# Altium schematic sheet Schemtaic Sheet 3.SchDoc
size A4; SheetNumber: 3; SheetTotal: 3
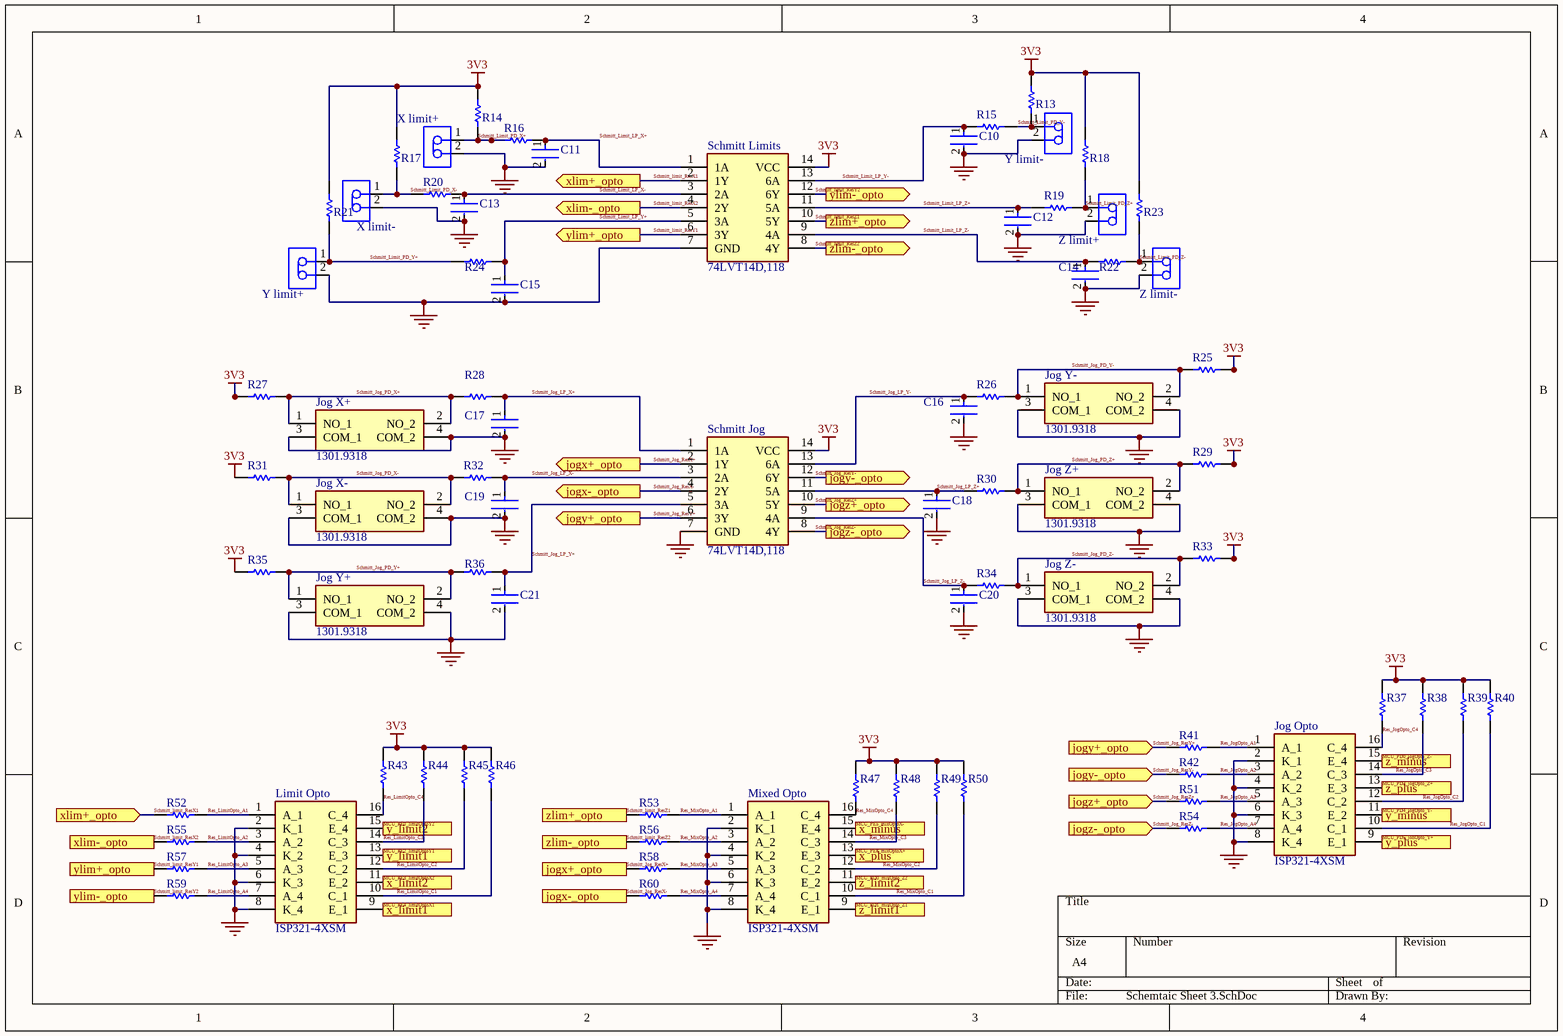
[diagram p0: Schemtaic Sheet 3.SchDoc]

## Parts
C10  K104K15X7RF5TH5  [FP-K15H5-MFG]  (value not drawn)
C11  K104K15X7RF5TH5  [FP-K15H5-MFG]  (value not drawn)
C12  K104K15X7RF5TH5  [FP-K15H5-MFG]  (value not drawn)
C13  K104K15X7RF5TH5  [FP-K15H5-MFG]  (value not drawn)
C14  K104K15X7RF5TH5  [FP-K15H5-MFG]  (value not drawn)
C15  K104K15X7RF5TH5  [FP-K15H5-MFG]  (value not drawn)
C16  K104K15X7RF5TH5  [FP-K15H5-MFG]  (value not drawn)
C17  K104K15X7RF5TH5  [FP-K15H5-MFG]  (value not drawn)
C18  K104K15X7RF5TH5  [FP-K15H5-MFG]  (value not drawn)
C19  K104K15X7RF5TH5  [FP-K15H5-MFG]  (value not drawn)
C20  K104K15X7RF5TH5  [FP-K15H5-MFG]  (value not drawn)
C21  K104K15X7RF5TH5  [FP-K15H5-MFG]  (value not drawn)
Jog_Opto  ISP321-4XSM  [SOP254P1016X460-16N]
Jog_X+  1301.9318  [13019318]
Jog_X-  1301.9318  [Model Name]
Jog_Y+  1301.9318  [13019318]
Jog_Y-  1301.9318  [13019318]
Jog_Z+  1301.9318  [13019318]
Jog_Z-  1301.9318  [13019318]
Limit_Opto  ISP321-4XSM  [SOP254P1016X460-16N]
Mixed_Opto  ISP321-4XSM  [SOP254P1016X460-16N]
R13  MFR-25FBF5210K  [RESA60-630X240]  (value not drawn)
R14  MFR-25FBF5210K  [RESA60-630X240]  (value not drawn)
R15  MFR-25FBF52-1K  [RESA60-630X240]  (value not drawn)
R16  MFR-25FBF52-1K  [RESA60-630X240]  (value not drawn)
R17  MFR-25FBF5210K  [RESA60-630X240]  (value not drawn)
R18  MFR-25FBF5210K  [RESA60-630X240]  (value not drawn)
R19  MFR-25FBF52-1K  [RESA60-630X240]  (value not drawn)
R20  MFR-25FBF52-1K  [RESA60-630X240]  (value not drawn)
R21  MFR-25FBF5210K  [RESA60-630X240]  (value not drawn)
R22  MFR-25FBF52-1K  [RESA60-630X240]  (value not drawn)
R23  MFR-25FBF5210K  [RESA60-630X240]  (value not drawn)
R24  MFR-25FBF52-1K  [RESA60-630X240]  (value not drawn)
R25  MFR-25FBF5210K  [RESA60-630X240]  (value not drawn)
R26  MFR-25FBF52-1K  [RESA60-630X240]  (value not drawn)
R27  MFR-25FBF5210K  [RESA60-630X240]  (value not drawn)
R28  MFR-25FBF52-1K  [RESA60-630X240]  (value not drawn)
R29  MFR-25FBF5210K  [RESA60-630X240]  (value not drawn)
R30  MFR-25FBF52-1K  [RESA60-630X240]  (value not drawn)
R31  MFR-25FBF5210K  [RESA60-630X240]  (value not drawn)
R32  MFR-25FBF52-1K  [RESA60-630X240]  (value not drawn)
R33  MFR-25FBF5210K  [RESA60-630X240]  (value not drawn)
R34  MFR-25FBF52-1K  [RESA60-630X240]  (value not drawn)
R35  MFR-25FBF5210K  [RESA60-630X240]  (value not drawn)
R36  MFR-25FBF52-1K  [RESA60-630X240]  (value not drawn)
R37  MFR-25FBF52-1K  [RESA60-630X240]  (value not drawn)
R38  MFR-25FBF52-1K  [RESA60-630X240]  (value not drawn)
R39  MFR-25FBF52-1K  [RESA60-630X240]  (value not drawn)
R40  MFR-25FBF52-1K  [RESA60-630X240]  (value not drawn)
R41  MFR-25FBF52-1K  [RESA60-630X240]  (value not drawn)
R42  MFR-25FBF52-1K  [RESA60-630X240]  (value not drawn)
R43  MFR-25FBF52-1K  [RESA60-630X240]  (value not drawn)
R44  MFR-25FBF52-1K  [RESA60-630X240]  (value not drawn)
R45  MFR-25FBF52-1K  [RESA60-630X240]  (value not drawn)
R46  MFR-25FBF52-1K  [RESA60-630X240]  (value not drawn)
R47  MFR-25FBF52-1K  [RESA60-630X240]  (value not drawn)
R48  MFR-25FBF52-1K  [RESA60-630X240]  (value not drawn)
R49  MFR-25FBF52-1K  [RESA60-630X240]  (value not drawn)
R50  MFR-25FBF52-1K  [RESA60-630X240]  (value not drawn)
R51  MFR-25FBF52-1K  [RESA60-630X240]  (value not drawn)
R52  MFR-25FBF52-1K  [RESA60-630X240]  (value not drawn)
R53  MFR-25FBF52-1K  [RESA60-630X240]  (value not drawn)
R54  MFR-25FBF52-1K  [RESA60-630X240]  (value not drawn)
R55  MFR-25FBF52-1K  [RESA60-630X240]  (value not drawn)
R56  MFR-25FBF52-1K  [RESA60-630X240]  (value not drawn)
R57  MFR-25FBF52-1K  [RESA60-630X240]  (value not drawn)
R58  MFR-25FBF52-1K  [RESA60-630X240]  (value not drawn)
R59  MFR-25FBF52-1K  [RESA60-630X240]  (value not drawn)
R60  MFR-25FBF52-1K  [RESA60-630X240]  (value not drawn)
Schmitt_Jog  74LVT14D,118  [SOIC127P600X175-14N]
Schmitt_Limits  74LVT14D,118  [SOIC127P600X175-14N]
X_limit+  B2B-PH-K-S(LF)(SN)  [JST-B2B-PH-K-S_V]  (value not drawn)
X_limit-  B2B-PH-K-S(LF)(SN)  [JST-B2B-PH-K-S_V]  (value not drawn)
Y_limit+  B2B-PH-K-S(LF)(SN)  [JST-B2B-PH-K-S_V]  (value not drawn)
Y_limit-  B2B-PH-K-S(LF)(SN)  [JST-B2B-PH-K-S_V]  (value not drawn)
Z_limit+  B2B-PH-K-S(LF)(SN)  [JST-B2B-PH-K-S_V]  (value not drawn)
Z_limit-  B2B-PH-K-S(LF)(SN)  [JST-B2B-PH-K-S_V]  (value not drawn)

## Ports
jogx+_opto (in, see Schemtaic Sheet 3[2B]), jogx+_opto (out, see Schemtaic Sheet 3[2D]), jogx-_opto (in, see Schemtaic Sheet 3[2B]), jogx-_opto (out, see Schemtaic Sheet 3[2D]), jogy+_opto (in, see Schemtaic Sheet 3[2C]), jogy+_opto (out, see Schemtaic Sheet 3[3C]), jogy-_opto (in, see Schemtaic Sheet 3[3B]), jogy-_opto (out, see Schemtaic Sheet 3[3D]), jogz+_opto (in, see Schemtaic Sheet 3[3B]), jogz+_opto (out, see Schemtaic Sheet 3[3D]), jogz-_opto (in, see Schemtaic Sheet 3[3C]), jogz-_opto (out, see Schemtaic Sheet 3[3D]), x_limit1 (out, see Schemtaic Sheet 2[3D]), x_limit2 (out, see Schemtaic Sheet 2[3C]), x_minus (out, see Schemtaic Sheet 2[2D]), x_plus (out, see Schemtaic Sheet 2[2C]), xlim+_opto (in, see Schemtaic Sheet 3[2A]), xlim+_opto (out, see Schemtaic Sheet 3[1D]), xlim-_opto (in, see Schemtaic Sheet 3[2A]), xlim-_opto (out, see Schemtaic Sheet 3[1D]), y_limit1 (out, see Schemtaic Sheet 2[3C]), y_limit2 (out, see Schemtaic Sheet 2[3C]), y_minus (out, see Schemtaic Sheet 2[3C]), y_plus (out, see Schemtaic Sheet 2[3B]), ylim+_opto (in, see Schemtaic Sheet 3[2A]), ylim+_opto (out, see Schemtaic Sheet 3[1D]), ylim-_opto (in, see Schemtaic Sheet 3[3A]), ylim-_opto (out, see Schemtaic Sheet 3[1D]), z_limit1 (out, see Schemtaic Sheet 2[3C]), z_limit2 (out, see Schemtaic Sheet 2[3C]), z_minus (out, see Schemtaic Sheet 2[3B]), z_plus (out, see Schemtaic Sheet 2[3C]), zlim+_opto (in, see Schemtaic Sheet 3[3A]), zlim+_opto (out, see Schemtaic Sheet 3[2D]), zlim-_opto (in, see Schemtaic Sheet 3[3A]), zlim-_opto (out, see Schemtaic Sheet 3[2D])

## Nets
3V3: R13.2 R14.2 R17.2 R18.2 R21.2 R23.2 R25.2 R27.1 R29.2 R31.1 R33.2 R35.1 R37.2 R38.2 R39.2 R40.2 R43.2 R44.2 R45.2 R46.2 R47.2 R48.2 R49.2 R50.2 Schmitt_Jog.14(VCC) Schmitt_Limits.14(VCC)
GND: C10.2 C11.2 C12.2 C13.2 C14.2 C15.2 C16.2 C17.2 C18.2 C19.2 C20.2 C21.2 Jog_Opto.2(K_1) Jog_Opto.4(K_2) Jog_Opto.6(K_3) Jog_Opto.8(K_4) Jog_X+.3(COM_1) Jog_X+.4(COM_2) Jog_X-.3(COM_1) Jog_X-.4(COM_2) Jog_Y+.3(COM_1) Jog_Y+.4(COM_2) Jog_Y-.3(COM_1) Jog_Y-.4(COM_2) Jog_Z+.3(COM_1) Jog_Z+.4(COM_2) Jog_Z-.3(COM_1) Jog_Z-.4(COM_2) Limit_Opto.2(K_1) Limit_Opto.4(K_2) Limit_Opto.6(K_3) Limit_Opto.8(K_4) Mixed_Opto.2(K_1) Mixed_Opto.4(K_2) Mixed_Opto.6(K_3) Mixed_Opto.8(K_4) Schmitt_Jog.7(GND) Schmitt_Limits.7(GND) X_limit+.2 X_limit-.2 Y_limit+.2 Y_limit-.2 Z_limit+.2 Z_limit-.2
MCU_PD0_jogOpto_Z-: Jog_Opto.15(E_4) ; port z_minus
MCU_PD0_mixOpto_Z2: Mixed_Opto.11(E_2) ; port z_limit2
MCU_PD1_mixOpto_Z1: Mixed_Opto.9(E_1) ; port z_limit1
MCU_PD3_jogOpto_Z+: Jog_Opto.13(E_3) ; port z_plus
MCU_PD4_jogOpto_Y-: Jog_Opto.11(E_2) ; port y_minus
MCU_PD5_johOpto_Y+: Jog_Opto.9(E_1) ; port y_plus
MCU_PE0_limitOptoY2: Limit_Opto.15(E_4) ; port y_limit2
MCU_PE2_limitOptoY1: Limit_Opto.13(E_3) ; port y_limit1
MCU_PE3_limitOptoX2: Limit_Opto.11(E_2) ; port x_limit2
MCU_PE4_limitOptoX1: Limit_Opto.9(E_1) ; port x_limit1
MCU_PE5_mixOptoX-: Mixed_Opto.15(E_4) ; port x_minus
MCU_PE8_mixOptoX+: Mixed_Opto.13(E_3) ; port x_plus
Res_JogOpto_A1: Jog_Opto.1(A_1) R41.2
Res_JogOpto_A2: Jog_Opto.3(A_2) R42.2
Res_JogOpto_A3: Jog_Opto.5(A_3) R51.2
Res_JogOpto_A4: Jog_Opto.7(A_4) R54.2
Res_JogOpto_C1: Jog_Opto.10(C_1) R40.1
Res_JogOpto_C2: Jog_Opto.12(C_2) R39.1
Res_JogOpto_C3: Jog_Opto.14(C_3) R38.1
Res_JogOpto_C4: Jog_Opto.16(C_4) R37.1
Res_LimitOpto_A1: Limit_Opto.1(A_1) R52.2
Res_LimitOpto_A2: Limit_Opto.3(A_2) R55.2
Res_LimitOpto_A3: Limit_Opto.5(A_3) R57.2
Res_LimitOpto_A4: Limit_Opto.7(A_4) R59.2
Res_LimitOpto_C1: Limit_Opto.10(C_1) R46.1
Res_LimitOpto_C2: Limit_Opto.12(C_2) R45.1
Res_LimitOpto_C3: Limit_Opto.14(C_3) R44.1
Res_LimitOpto_C4: Limit_Opto.16(C_4) R43.1
Res_MixOpto_A1: Mixed_Opto.1(A_1) R53.2
Res_MixOpto_A2: Mixed_Opto.3(A_2) R56.2
Res_MixOpto_A3: Mixed_Opto.5(A_3) R58.2
Res_MixOpto_A4: Mixed_Opto.7(A_4) R60.2
Res_MixOpto_C1: Mixed_Opto.10(C_1) R50.1
Res_MixOpto_C2: Mixed_Opto.12(C_2) R49.1
Res_MixOpto_C3: Mixed_Opto.14(C_3) R48.1
Res_MixOpto_C4: Mixed_Opto.16(C_4) R47.1
Schmitt_Jog_LP_X+: C17.1 R28.2 Schmitt_Jog.1(1A)
Schmitt_Jog_LP_X-: C19.1 R32.2 Schmitt_Jog.3(2A)
Schmitt_Jog_LP_Y+: C21.1 R36.2 Schmitt_Jog.5(3A)
Schmitt_Jog_LP_Y-: C16.1 R26.1 Schmitt_Jog.13(6A)
Schmitt_Jog_LP_Z+: C18.1 R30.1 Schmitt_Jog.11(5A)
Schmitt_Jog_LP_Z-: C20.1 R34.1 Schmitt_Jog.9(4A)
Schmitt_Jog_PD_X+: Jog_X+.1(NO_1) Jog_X+.2(NO_2) R27.2 R28.1
Schmitt_Jog_PD_X-: Jog_X-.1(NO_1) Jog_X-.2(NO_2) R31.2 R32.1
Schmitt_Jog_PD_Y+: Jog_Y+.1(NO_1) Jog_Y+.2(NO_2) R35.2 R36.1
Schmitt_Jog_PD_Y-: Jog_Y-.1(NO_1) Jog_Y-.2(NO_2) R25.1 R26.2
Schmitt_Jog_PD_Z+: Jog_Z+.1(NO_1) Jog_Z+.2(NO_2) R29.1 R30.2
Schmitt_Jog_PD_Z-: Jog_Z-.1(NO_1) Jog_Z-.2(NO_2) R33.1 R34.2
Schmitt_Jog_ResX+: R58.1 Schmitt_Jog.2(1Y) ; port jogx+_opto
Schmitt_Jog_ResX-: R60.1 Schmitt_Jog.4(2Y) ; port jogx-_opto
Schmitt_Jog_ResY+: R41.1 Schmitt_Jog.6(3Y) ; port jogy+_opto
Schmitt_Jog_ResY-: R42.1 Schmitt_Jog.12(6Y) ; port jogy-_opto
Schmitt_Jog_ResZ+: R51.1 Schmitt_Jog.10(5Y) ; port jogz+_opto
Schmitt_Jog_ResZ-: R54.1 Schmitt_Jog.8(4Y) ; port jogz-_opto
Schmitt_Limit_LP_X+: C11.1 R16.2 Schmitt_Limits.1(1A)
Schmitt_Limit_LP_X-: C13.1 R20.2 Schmitt_Limits.3(2A)
Schmitt_Limit_LP_Y+: C15.1 R24.2 Schmitt_Limits.5(3A)
Schmitt_Limit_LP_Y-: C10.1 R15.1 Schmitt_Limits.13(6A)
Schmitt_Limit_LP_Z+: C12.1 R19.1 Schmitt_Limits.11(5A)
Schmitt_Limit_LP_Z-: C14.1 R22.1 Schmitt_Limits.9(4A)
Schmitt_Limit_PD_X+: R14.1 R16.1 X_limit+.1
Schmitt_Limit_PD_X-: R17.1 R20.1 X_limit-.1
Schmitt_Limit_PD_Y+: R21.1 R24.1 Y_limit+.1
Schmitt_Limit_PD_Y-: R13.1 R15.2 Y_limit-.1
Schmitt_Limit_PD_Z+: R18.1 R19.2 Z_limit+.1
Schmitt_Limit_PD_Z-: R22.2 R23.1 Z_limit-.1
Schmitt_limit_ResX1: R52.1 Schmitt_Limits.2(1Y) ; port xlim+_opto
Schmitt_limit_ResX2: R55.1 Schmitt_Limits.4(2Y) ; port xlim-_opto
Schmitt_limit_ResY1: R57.1 Schmitt_Limits.6(3Y) ; port ylim+_opto
Schmitt_limit_ResY2: R59.1 Schmitt_Limits.12(6Y) ; port ylim-_opto
Schmitt_limit_ResZ1: R53.1 Schmitt_Limits.10(5Y) ; port zlim+_opto
Schmitt_limit_ResZ2: R56.1 Schmitt_Limits.8(4Y) ; port zlim-_opto

## Library data of the parts
C10-C21 = CMP-02417-000078-1: CAP CER 0.1UF 50V X7R RADIAL; Capacitance: 100nF; Tolerance: 10%; Dielectric Material: Ceramic; Lead Length: 30mm; Lead Diameter: 0.5mm; Lead/Base Style: Formed Leads; Diameter: 500um; Max Operating Temperature: 125°C; Case/Package: Dipped; Dielectric: X7R; Lead Free: Lead Free; Construction: RADIAL; Voltage: 50V; Thickness: 2.6mm; Min Operating Temperature: -55°C; Lead Pitch: 5mm; Height: 4mm; Radiation Hardening: No; Voltage Rating: 50V; Depth: 2.5mm; Voltage Rating (DC): 50V; Package Quantity: 1; Weight: 0.005644oz; Series: K; Mount: Through Hole; Termination: Radial; Height - Seated (Max): 0.257inch; Length: 4mm; Packaging: Tape and Reel; Width: 2.5mm; RoHS Compliant: Yes
Jog_Opto Limit_Opto Mixed_Opto = ISP321-4XSM: Phototransistor; Manufacturer_Name: Isocom; Datasheet Link: http://isocom.com/wp-content/uploads/2017/08/DD93207-ISP321-1-2-4_20_01_17.pdf; Height: 4.6mm; Manufacturer_Part_Number: ISP321-4XSM
Jog_X+ Jog_X- Jog_Y+ Jog_Y- Jog_Z+ Jog_Z- = 1301.9318: IP40 Black Button Tactile Switch, SPST-NO 4.4mm; Manufacturer_Name: SCHURTER; Geometry.Height: 8mm; Manufacturer_Part_Number: 1301.9318; Mouser Part Number: 693-1301.9318; Mouser Price/Stock: https://www.mouser.co.uk/ProductDetail/Schurter/13019318?qs=tGaZrb6HVSaxYojxkk2y5w%3D%3D; Arrow Part Number: *; Arrow Price/Stock: *; Datasheet Link: https://componentsearchengine.com/Datasheets/2/1301.9318.pdf
R13 R14 R17 R18 R21 R23 R25 R27 R29 R31 R33 R35 = CMP-1659-00074-2: Axial Resistor, 10 KOhm, +/- 1%, 0.25 W, -55 to 155 degC, 2-Pin THD, RoHS, Bulk; Manufacturer: Yageo; Temperature Coefficient: 100ppm\/degreesC; Voltage Rating: 250V; Voltage Rating (DC): 200V; Resistance: 10KOhm; Max Power Dissipation: 250mW; Datasheet URL: http://www.yageo.com/documents/recent/Yageo%20LR_MFR_2013.pdf; Packaging: Bulk; RoHSCompliant: True; Mount: ThroughHole; Package Reference: MFR-25; Termination: Axial; Composition: MetalFilm; Number of Terminations: 2; Package Quantity: 200; Mounting Technology: ThroughHole; Length: 0.248inch; Max Operating Temperature: 155degC; Min Operating Temperature: -55degC; Datasheet Version: 04/2013; Lead Free: LeadFree; Manufacturer URL: http://www.yageo.com/; Tolerance: 1%; Power Rating: 250mW; Package Description: 2-Pin Axial Lead, Dia 2.4 mm, Body Length 6.3 mm; Military Standard: Not; Case\/Package: Axial
R15 R16 R19 R20 R22 R24 R26 R28 R30 R32 R34 R36-R60 = CMP-1659-00075-1: Axial Resistor, 1 KOhm, +/- 1%, 250 mW, -55 to 155 degC, 2-Pin THD, RoHS, Bulk; Voltage Rating: 250 V; Resistance: 10 kohm; Power Rating: 250 mW; ComponentLink2Description: Datasheet; RoHSCompliant: true; PackageReference: MFR-25; Case\Package: Axial; Max Operating Temperature: 155 degC; DatasheetVersion: Apr-13; Tolerance: 1%; ComponentLink1URL: http://www.yageo.com/; Length: 0.248 inch; ComponentLink2URL: http://www.yageo.com/documents/recent/Yageo%20LR_MFR_2013.pdf; Packaging: Bulk; Package Quantity: 200; PackageDescription: 2-Pin Axial Lead, Dia 2.4 mm, Body Length 6.3 mm; Min Operating Temperature: -55 degC; ComponentLink1Description: Manufacturer URL
Schmitt_Jog Schmitt_Limits = 74LVT14D,118: Integrated Circuit; Manufacturer_Name: Nexperia; Datasheet Link: https://assets.nexperia.com/documents/data-sheet/74LVT14.pdf; Height: 1.75mm; Manufacturer_Part_Number: 74LVT14D,118; Mouser Part Number: 771-74LVT14D-T; Mouser Price/Stock: https://www.mouser.co.uk/ProductDetail/Nexperia/74LVT14D118?qs=me8TqzrmIYWhjwZFM6w3Mg%3D%3D; Arrow Part Number: 74LVT14D,118; Arrow Price/Stock: https://www.arrow.com/en/products/74lvt14d118/nexperia?region=nac
X_limit+ X_limit- Y_limit+ Y_limit- Z_limit+ Z_limit- = CMP-2000-05162-1: Male Header, Pitch 2 mm, 1 x 2 Position, Height 6 mm, Tail Length 3.4 mm, -25 to 85 degC, RoHS, Bulk; Manufacturer: JST; Pitch: 2mm; Style/Orientation: StraightHeader/Plug; No of Positions: 2; Datasheet Version: Nov-08; Datasheet URL: http://datasheet.octopart.com/B2B-PH-K-S%28LF%29%28SN%29-JST-datasheet-8324864.pdf; Manufacturer URL: http://www.jst.com/home2.html; Type: ShroudedHeader; Termination: Crimp